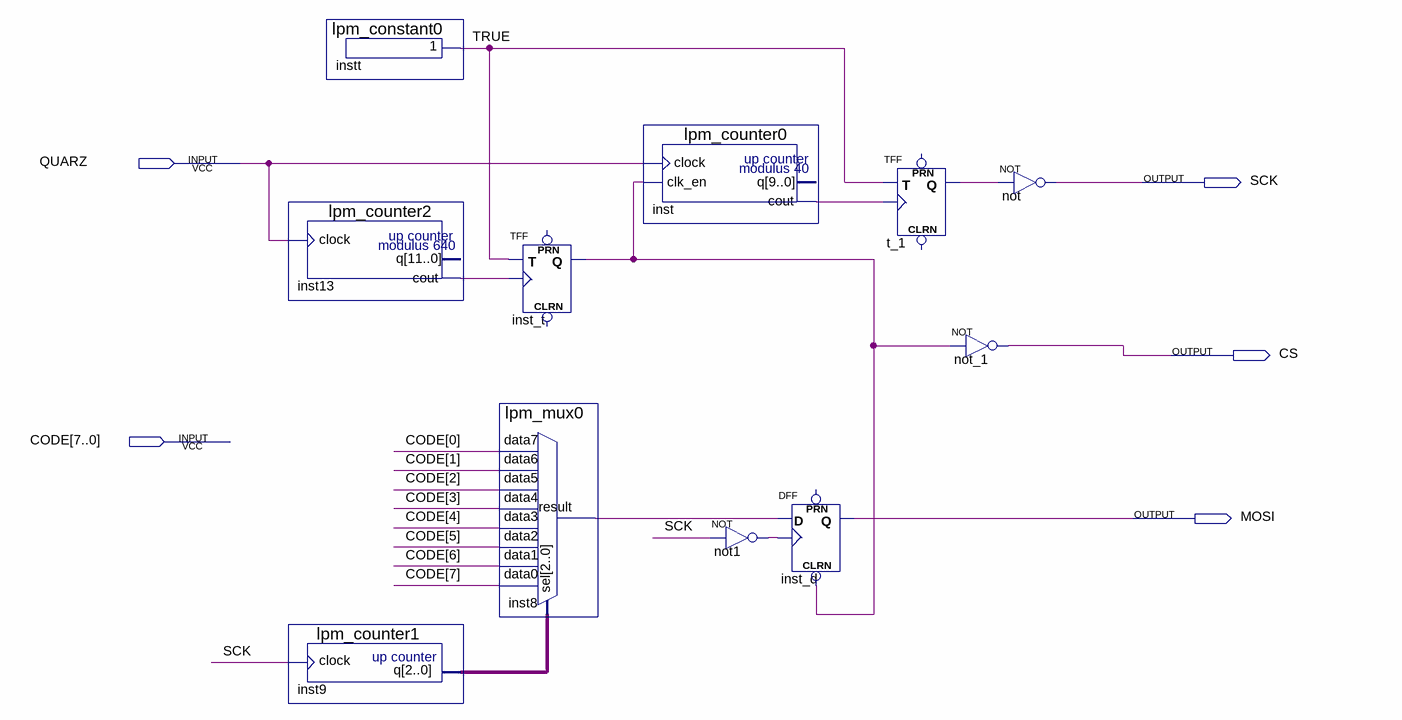
[diagram p0: schematic sheet]
// Quartus schematic lab1.bdf as structural Verilog: 11 symbols, 5 pins
module lab1 (
  input  QUARZ,
  input  [7:0] CODE,
  output SCK,
  output CS,
  output MOSI
);

  wire inst8_result, inst13_cout, inst_cout, inst_t_q, not1_out, t_1_q, TRUE;
  wire [2:0] inst9_q;

  lpm_counter2 inst13 (.clock(QUARZ), .cout(inst13_cout));  // open: q
  lpm_counter1 inst9 (.clock(SCK), .q(inst9_q));
  lpm_constant0 instt (.result(TRUE));
  TFF inst_t (.T(TRUE), .CLK(inst13_cout), .Q(inst_t_q));  // open: PRN, CLRN
  lpm_mux0 inst8 (
    .data7(CODE[0]), .data6(CODE[1]), .data5(CODE[2]), .data4(CODE[3]), .data3(CODE[4]), .data2(CODE[5]),
    .data1(CODE[6]), .data0(CODE[7]), .sel(inst9_q), .result(inst8_result));
  lpm_counter0 inst (.clock(QUARZ), .clk_en(inst_t_q), .cout(inst_cout));  // open: q
  not not1 (not1_out, SCK);
  DFF inst_d (.CLRN(inst_t_q), .CLK(not1_out), .D(inst8_result), .Q(MOSI));  // open: PRN
  TFF t_1 (.T(TRUE), .CLK(inst_cout), .Q(t_1_q));  // open: PRN, CLRN
  not not_1 (CS, inst_t_q);
  not \not  (SCK, t_1_q);
endmodule
